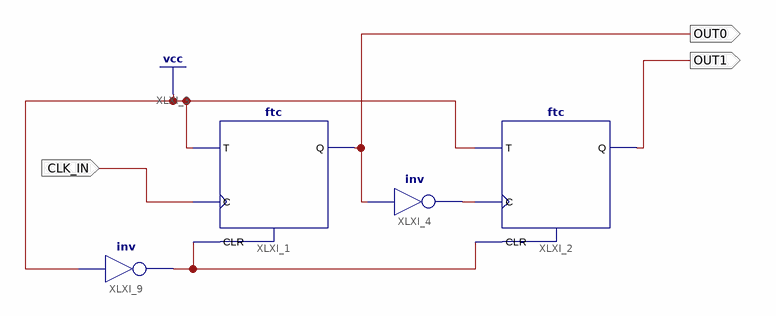
[diagram p0: schematic sheet 1]
// Xilinx ISE schematic twoBitCounter.sch (spartan6) as structural Verilog: 4 symbols, 3 ports
module twoBitCounter (
  input  CLK_IN,
  output OUT0,
  output OUT1
);

  wire XLXN_4, XLXN_8;

  ftc XLXI_1 (.C(CLK_IN), .CLR(XLXN_8), .T(1'b1), .Q(OUT0));
  ftc XLXI_2 (.C(XLXN_4), .CLR(XLXN_8), .T(1'b1), .Q(OUT1));
  not XLXI_4 (XLXN_4, OUT0);
  not XLXI_9 (XLXN_8, 1'b1);
endmodule
